# EAGLE design Reflow Panel Rev D (EAGLE 7.5.0)
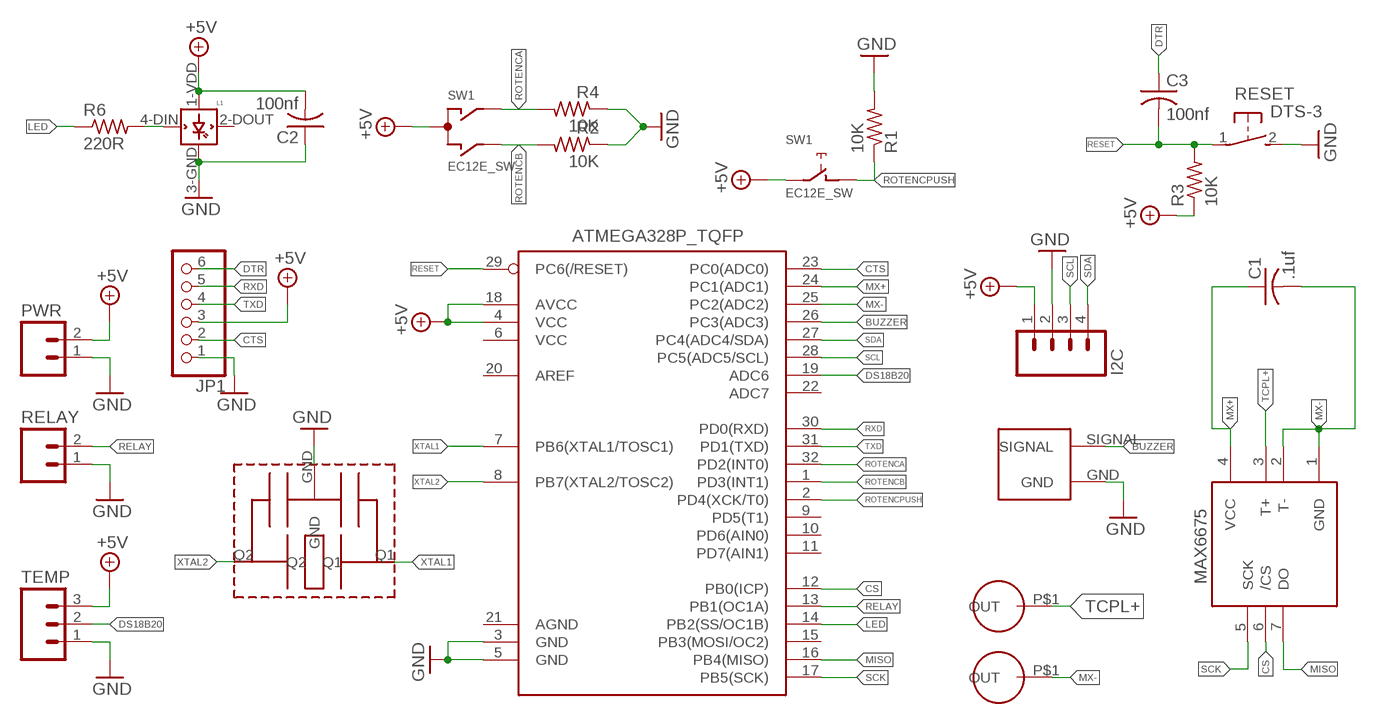
[diagram p0: schematic, sheet 1]

## Parts
C1  .1uf  C-USC0805  [C0805]
C2  100nf  C-USC0805  [C0805]
C3  100nf  C-USC0805  [C0805]
I2C  M04LOCK_LONGPADS  [1X04_LOCK_LONGPADS]
IC2  MAX6675  [SO08]
JP1  PINHD-1X6LOCK  [1X06-BIGLOCK]
L1  WS2812B_  [WS2812B]
PWR  M02LOCK  [1X02_LOCK]
R1  10K  R-US_M0805  [M0805]
R2  10K  R-US_M0805  [M0805]
R3  10K  R-US_M0805  [M0805]
R4  10K  R-US_M0805  [M0805]
R6  220R  R-US_M0805  [M0805]
RELAY  M02LOCK  [1X02_LOCK]
RESET  DTS-3  [DTS-3]
SW1  EC12E_SW  [ALPS_EC12E_SW]
TEMP  M03LOCK  [1X03_LOCK]
U1  ATMEGA328P_TQFP  [TQFP32-08]
U$1  8.5MMSQUAREBUZZER  [8.5MMSQUAREBUZZER]
U$2  CSTCE16M0V53-R0  [CSTCE_V13C]
U$3  BANANAFEMAIL-10.8-5.7  [BANANAFEMALE-10.8-5.7]
U$4  BANANAFEMAIL-10.8-5.7  [BANANAFEMALE-10.8-5.7]

## Nets
+5V: C2.2 I2C.1 JP1.3 L1.1-VDD(VDD) PWR.2 R3.1 SW1.C SW1.E TEMP.3 U1.4(VCC) U1.18(AVCC)
BUZZER: U1.26(PC3(ADC3)) U$1.SIGNAL
CS: IC2.6(/CS) U1.12(PB0(ICP))
CTS: JP1.2 U1.23(PC0(ADC0))
DS18B20: TEMP.2 U1.19(ADC6)
DTR: C3.1 JP1.6
GND: C2.1 I2C.2 JP1.1 L1.3-GND(GND) PWR.1 R1.2 R2.1 R4.1 RELAY.1 RESET.2 TEMP.1 U1.3(GND) U1.5(GND) U$1.GND U$2.GND
LED: R6.1 U1.14(PB2(SS/OC1B))
MISO: IC2.7(DO) U1.16(PB4(MISO))
MX+: C1.1 IC2.4(VCC) U1.24(PC1(ADC1))
MX-: C1.2 IC2.1(GND) IC2.2(T-) U1.25(PC2(ADC2)) U$3.P$1(OUT)
N$1: L1.4-DIN(DIN) R6.2
RELAY: RELAY.2 U1.13(PB1(OC1A))
RESET: C3.2 R3.2 RESET.1 U1.29(PC6(/RESET))
ROTENCA: R4.2 SW1.A U1.32(PD2(INT0))
ROTENCB: R2.2 SW1.B U1.1(PD3(INT1))
ROTENCPUSH: R1.1 SW1.D U1.2(PD4(XCK/T0))
RXD: JP1.5 U1.30(PD0(RXD))
SCK: IC2.5(SCK) U1.17(PB5(SCK))
SCL: I2C.3 U1.28(PC5(ADC5/SCL))
SDA: I2C.4 U1.27(PC4(ADC4/SDA))
TCPL+: IC2.3(T+) U$4.P$1(OUT)
TXD: JP1.4 U1.31(PD1(TXD))
XTAL1: U1.7(PB6(XTAL1/TOSC1)) U$2.Q1
XTAL2: U1.8(PB7(XTAL2/TOSC2)) U$2.Q2
Unconnected: L1.2-DOUT(DOUT) SW1.GND1(G) SW1.GND2(G) U1.6(VCC) U1.9(PD5(T1)) U1.10(PD6(AIN0)) U1.11(PD7(AIN1)) U1.15(PB3(MOSI/OC2)) U1.20(AREF) U1.21(AGND) U1.22(ADC7)

## Library data of the parts
C1-C3 = rcl:C-US: CAPACITOR, American symbol
I2C = User-Submitted:M04: Header 4 Standard 4-pin 0.1" header. Use with straight break away headers (SKU : PRT-00116), right angle break away headers (PRT-00553), swiss pins (PRT-00743), machine pins (PRT-00117), and female headers (PRT-00115). Molex polarized connector foot print use with SKU : PRT-08231 with associated crimp pins and housings. 1MM SMD Version SKU: PRT-10208
IC2 = adafruit:MAX6675
JP1 = adafruit:PINHD-1X6: PIN HEADER
L1 = adafruit:WS2812B_
PWR RELAY = SparkFun-Connectors:M02: Standard 2-pin 0.1" header. Use with - straight break away headers ( PRT-00116) - right angle break away headers (PRT-00553) - swiss pins (PRT-00743) - machine pins (PRT-00117) - female headers (PRT-00115) Molex polarized connector foot print use with: PRT-08233 with associated crimp pins and housings. 2.54_SCREWTERM for use with PRT-10571. 3.5mm Screw Terminal footprints for PRT-08084 5mm Screw Terminal footprints for use with PRT-08432
R1-R4 R6 = rcl:R-US_: RESISTOR, American symbol
RESET = switch-tact:DTS-3
SW1 = switch-alps:EC12E_SW: ALPS rotary Encoder EC12E series with switch; MPN: EC12E2424407; OC_FARNELL: 1520813; OC_NEWARK: 74M1068
TEMP = SparkFun-Connectors:M03: Header 3 Standard 3-pin 0.1" header. Use with straight break away headers (SKU : PRT-00116), right angle break away headers (PRT-00553), swiss pins (PRT-00743), machine pins (PRT-00117), and female headers (PRT-00115). Molex polarized connector foot print use with SKU : PRT-08232 with associated crimp pins and housings.
U1 = SparkFun-DigitalIC:ATMEGA328P_TQFP; PROD_ID: IC-09069
U$1 = custom:8.5MMSQUAREBUZZER
U$2 = custom:CSTCE16M0V53-R0
U$3 U$4 = custom:BANANAFEMAIL-10.8-5.7

## Board
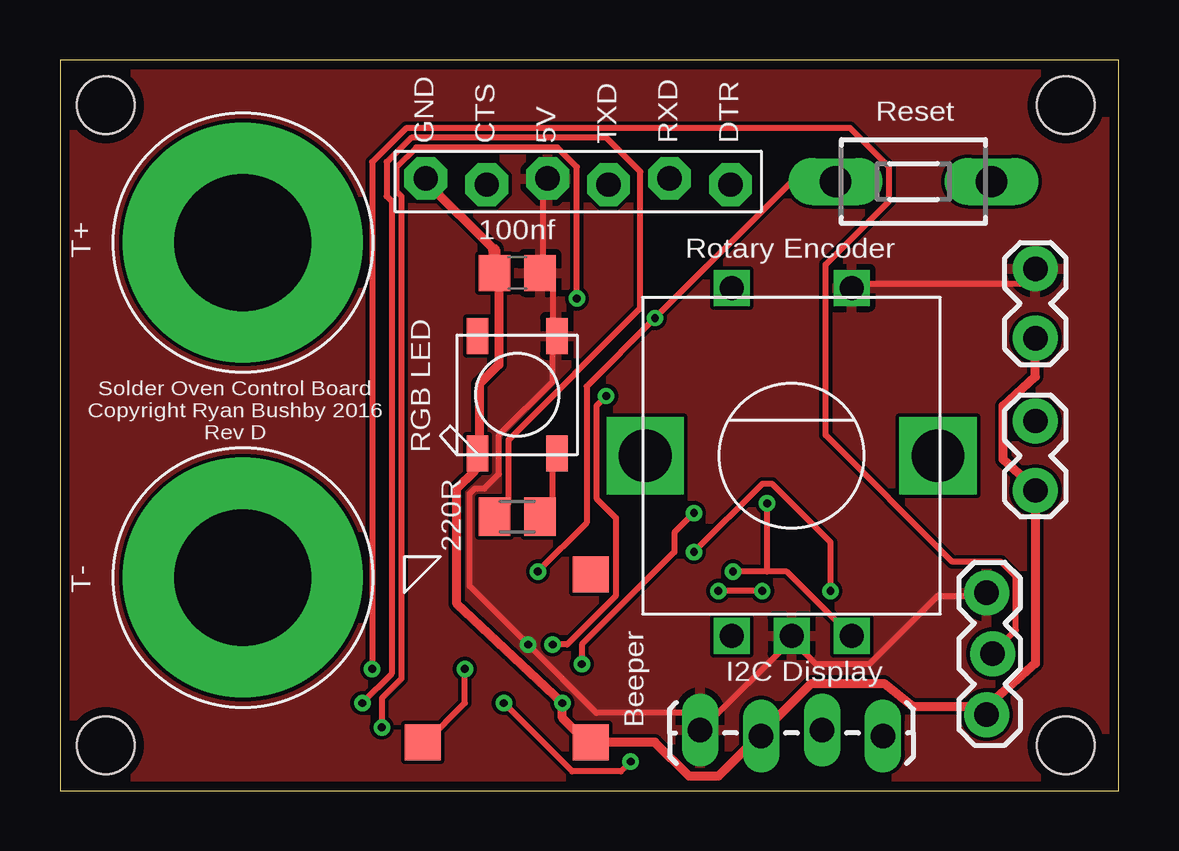
[diagram p1: board, top side]
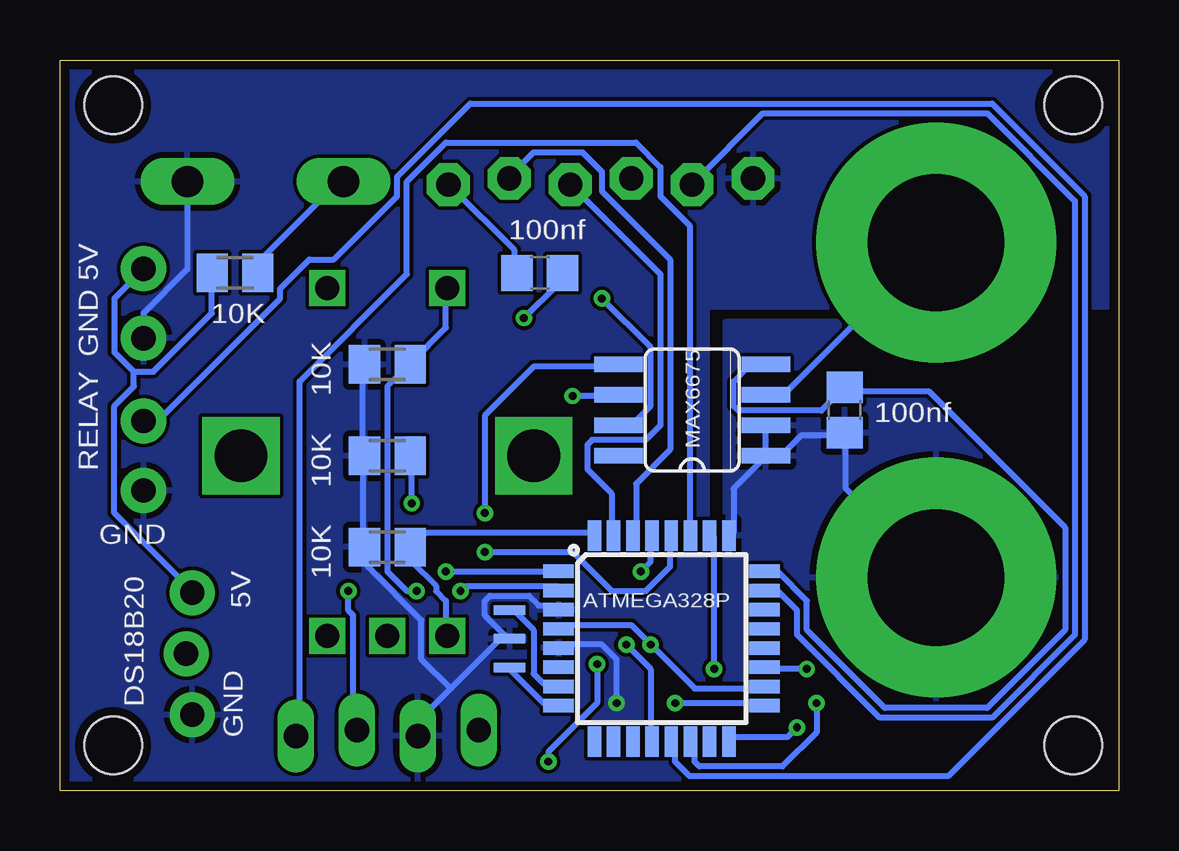
[diagram p2: board, bottom side, seen from below]

Size 44.12 x 30.47 mm. Coordinates in mm from the lower left corner, seen from the top.
Outline: 0,0 44.12,0 44.12,30.47 0,30.47 0,0
Copper layers (1*16): Top 0.0356mm / dielectric 1.5011mm / Bottom 0.0356mm
Design rules "LaenPCBOrder *": minimum track width 10mil, minimum drill 13mil, track to track 6mil, track to pad 6mil, pad to pad 6mil, via to via 6mil, smd to smd 6mil, copper to edge 15mil, drill to drill 6mil, minimum pad ring 7mil, minimum via ring 7mil, stop-mask expansion 3mil, vias tented up to drill 1000mil, thermal gap 10mil
Holes 2.4 mm at 1.91,1.91 1.91,28.57 41.91,28.57 41.91,1.91

### Footprints (pad centres in the part's own frame; a part is rotated, then mirrored left to right if it is on the bottom)
C0805 = smd 1.3 x 1.5: 1 -0.95,0; 2 0.95,0
1X04_LOCK_LONGPADS = drill 1.016 long: 1 0,0; 2 2.54,-0.254; 3 5.08,0; 4 7.62,-0.254
SO08 = smd 0.66 x 2.032: 1 -1.905,-3.073; 2 -0.635,-3.073; 3 0.635,-3.073; 4 1.905,-3.073; 5 1.905,3.073; 6 0.635,3.073; 7 -0.635,3.073; 8 -1.905,3.073
1X06-BIGLOCK = drill 1.016 pad 1.778 octagon: 1 -6.35,0.127; 2 -3.81,-0.127; 3 -1.27,0.127; 4 1.27,-0.127; 5 3.81,0.127; 6 6.35,-0.127
WS2812B = smd 1.5 x 0.9: 1-VDD 2.45,-1.65; 2-DOUT 2.45,1.65; 3-GND -2.45,1.65; 4-DIN -2.45,-1.65
1X02_LOCK = drill 1.016 pad 1.88: 1 -0.178,0; 2 2.718,0
M0805 = smd 1.3 x 1.6: 1 -0.95,0; 2 0.95,0
DTS-3 = drill 1.3 long: 1 -3.25,0; 2 3.25,0
ALPS_EC12E_SW = drill 1 square: A -2.5,-7.5; B 2.5,-7.5; C 0,-7.5; D -2.5,7; E 2.5,7 | drill 2.2 square: GND1 -6.1,0; GND2 6.1,0
1X03_LOCK = drill 1.016 pad 1.88: 1 0,0.127; 2 2.54,-0.127; 3 5.08,0.127
TQFP32-08 = smd 1.27 x 0.559: 1 -4.293,2.8; 2 -4.293,2; 3 -4.293,1.2; 4 -4.293,0.4; 5 -4.293,-0.4; 6 -4.293,-1.2; 7 -4.293,-2; 8 -4.293,-2.8; 17 4.293,-2.8; 18 4.293,-2; 19 4.293,-1.2; 20 4.293,-0.4; 21 4.293,0.4; 22 4.293,1.2; 23 4.293,2; 24 4.293,2.8 | smd 0.559 x 1.27: 9 -2.8,-4.293; 10 -2,-4.293; 11 -1.2,-4.293; 12 -0.4,-4.293; 13 0.4,-4.293; 14 1.2,-4.293; 15 2,-4.293; 16 2.8,-4.293; 25 2.8,4.293; 26 2,4.293; 27 1.2,4.293; 28 0.4,4.293; 29 -0.4,4.293; 30 -1.2,4.293; 31 -2,4.293; 32 -2.8,4.293
8.5MMSQUAREBUZZER = smd 1.5 x 1.5: GND 8.14,0.75; P$3 8.14,7.75; SIGNAL 1.14,0.75
CSTCE_V13C = smd 0.4 x 1.3: GND 0.01,0.01; Q1 -1.19,0.01; Q2 1.21,0.01
BANANAFEMALE-10.8-5.7 = drill 5.7 pad 10: P$1 0,0

### Placement (x,y rotation side)
C1  11.43,15.88 270 bottom
C2  19.05,21.59 0 top
C3  24.13,21.59 0 bottom
I2C  26.67,2.54 0 top
IC2  17.78,15.88 90 bottom
JP1  21.59,25.4 0 top
L1  19.05,16.51 90 top
PWR  40.64,19.05 90 top
R1  30.48,17.78 180 bottom
R2  30.48,13.97 0 bottom
R3  36.83,21.59 0 bottom
R4  30.48,10.16 0 bottom
R6  19.05,11.43 0 top
RELAY  40.64,12.7 90 top
RESET  35.56,25.4 0 top
SW1  30.48,13.97 0 top
TEMP  38.73,3.17 90 top
U1  19.05,6.35 0 bottom
U$1  13.97,1.27 0 top
U$2  25.4,6.35 270 bottom
U$3  7.62,8.89 0 top
U$4  7.62,22.86 0 top

### Tracks (layer width: path | path; a pad name or v marks a point on that pad's centre or on a via)
+5V  (via drill 0.33)
  Top 0.254: SW1.E 33.12,21.13 40.03,21.13 40.64,21.74 PWR.2 | JP1.3 20.32,25.4 20.12,25.2 20.12,21.74 C2.2 20.12,21.54 20.52,21.13 20.52,19.1 L1.1-VDD 20.52,18.9 20.52,17.07 18.29,14.83 18.29,13.21 17.68,12.6 17.27,12.6 17.07,12.39 17.07,8.53 v19.51,6.1 22.35,3.25 26.01,3.25 26.62,2.64 I2C.1 26.82,2.64 30.48,6.3 | 30.48,6.3 31.5,5.28 33.73,5.28 36.58,8.13 38.61,8.13 TEMP.3 | 30.48,6.3 SW1.C
  Bottom 0.254: 41.05,17.48 40.23,17.48 37.8,19.91 37.8,21.54 R3.1 | 41.05,17.48 41.86,18.29 41.86,20.52 40.64,21.74 PWR.2 | U1.18 14.83,4.27 17.68,4.27 v19.51,6.1 20.32,6.91 23.16,6.91 U1.4 | 41.05,17.48 41.05,16.87 41.86,16.05 41.86,11.58 38.61,8.33 TEMP.3
  pour Top: 0,30.48 44.45,30.48 44.45,0 0,0
BUZZER  (via drill 0.33)
  Top 0.254: v16.87,5.08 16.87,3.66 15.24,2.03 U$1.SIGNAL
  Bottom 0.254: v16.87,5.08 16.87,10.57 U1.26
CS  (via drill 0.33)
  Top 0.254: v20.52,6.1 21.13,6.1 23.16,8.13 23.16,11.38 22.35,12.19 22.35,16.05 v22.76,16.46
  Bottom 0.254: v20.52,6.1 19.51,5.08 19.51,2.23 U1.12 | v22.76,16.46 20.93,16.46 IC2.6
CTS
  Bottom 0.254: U1.23 14.63,8.33 14.22,8.33 13.41,7.52 13.41,6.5 9.96,3.05 5.28,3.05 1.83,6.5 1.83,24.59 5.49,28.25 14.83,28.25 17.68,25.4 JP1.2
DS18B20  (via drill 0.33)
  Top 0.254: v13.01,5.08 13.01,26.21 14.43,27.64 32.92,27.64 34.54,26.01 34.54,24.59 31.9,21.95 31.9,14.83 37.19,9.55 39.22,9.55 39.83,8.94 39.83,6.71 39.01,5.89 TEMP.2
  Bottom 0.254: v13.01,5.08 14.63,5.08 U1.19
DTR
  Bottom 0.254: C3.1 25.2,21.74 25.2,22.55 27.84,25.2 JP1.6
GND  (via drill 0.33)
  Top 0.254: 40.64,12.6 RELAY.1 | 17.48,14.22 L1.3-GND 17.27,14.02 | 18.29,21.54 C2.1 18.09,21.74 | 21.95,2.03 U$1.GND 22.15,2.03 | 29.06,2.23 I2C.2 29.26,2.44 | 38.61,3.25 TEMP.1
  Top 0.381: 38.61,3.53 TEMP.1 | 38.61,3.53 40.64,5.31 RELAY.1 | PWR.1 40.64,17.27 39.29,16.05 39.29,13.82 40.64,12.6 | 17.48,14.22 17.48,16.95 18.29,17.77 18.29,21.54 | 18.09,22.55 15.24,25.4 JP1.1 | 21.95,2.03 20.93,3.05 v20.93,3.66 16.54,7.8 16.54,12.6 17.27,13.34 17.27,14.02 | 22.15,2.03 24.79,2.03 26.21,0.61 27.43,0.61 29.06,2.23 | 38.61,3.53 35.53,3.53 34.34,4.47 31.29,4.47 29.26,2.44
  Top 0.508: 18.09,22.55 18.09,21.74
  Bottom 0.254: PWR.1 40.64,19.91 38.81,21.74 RESET.2 | 15.24,25.4 JP1.1 | R1.2 31.5,17.68 31.5,14.02 R2.1 31.5,13.82 31.5,10.16 R4.1 31.29,10.16 31.29,9.35 29.06,7.11 29.06,5.49 27.84,4.27 | v20.93,3.66 20.93,5.49 21.54,6.1 23.16,6.1 U1.5 | 25.6,6.5 25.4,6.3 U$2.GND 25.6,6.5 | 25.6,6.5 26.42,7.32 26.42,7.92 26.21,8.13 24.59,8.13 24.18,7.72 23.37,7.72 U1.3 | 27.84,4.27 29.06,3.05 29.06,2.44 I2C.2 | 27.84,4.27 25.6,6.5
  pour Bottom: 44.2,0 17.14,0 17.14,20.19 0.13,20.19 0.13,30.61 44.2,30.61
LED  (via drill 0.33)
  Top 0.254: v12.6,3.66 13.82,4.88 13.82,24.59 13.61,24.79 13.61,26.21 14.63,27.23 22.76,27.23 24.18,25.81 24.18,20.12 18.69,14.63 18.69,11.99 18.29,11.58 R6.1
  Bottom 0.254: v12.6,3.66 12.6,2.44 14.02,1.02 17.48,1.02 17.68,1.22 17.68,2.03 U1.14
MISO  (via drill 0.33)
  Top 0.254: v13.41,2.64 13.41,3.86 14.22,4.67 14.22,24.79 14.02,24.99 14.02,26.01 14.83,26.82 20.73,26.82 21.54,26.01 v21.54,20.52
  Bottom 0.254: v13.41,2.64 13.82,2.23 16.05,2.23 U1.16 | v21.54,20.52 19.51,18.49 19.51,16.05 20.32,15.24 IC2.7
MX+
  Bottom 0.254: U1.24 14.63,9.14 14.22,9.14 13.01,7.92 13.01,6.71 9.75,3.45 5.49,3.45 2.23,6.71 2.23,10.97 7.92,16.66 11.38,16.66 C1.1 11.58,16.66 12.39,15.85 15.85,15.85 16.05,16.05 16.05,17.07 15.44,17.68 14.83,17.68 IC2.4
MX-
  Bottom 0.254: U1.25 16.05,10.77 16.05,12.6 14.83,13.82 IC2.1 14.63,14.02 | 14.63,14.02 14.02,14.02 13.21,14.83 11.58,14.83 C1.2 11.38,14.83 11.38,12.6 7.72,8.94 U$3.P$1 | 14.63,14.02 14.71,14.02 IC2.2
  pour Bottom: 16.38,-0.13 16.38,19.56 0,19.56 0,-0.13
N$1
  Top 0.254: L1.4-DIN 20.52,14.02 20.52,11.99 20.12,11.58 R6.2
RELAY
  Bottom 0.254: U1.13 18.49,2.03 18.49,1.22 17.88,0.61 7.11,0.61 1.42,6.3 1.42,24.79 5.28,28.65 27.03,28.65 30.07,25.6 30.07,24.79 32.72,22.15 33.73,22.15 34.95,20.93 34.95,20.52 40.03,15.44 40.64,15.44 RELAY.2
RESET  (via drill 0.33)
  Top 0.254: v19.91,9.14 21.95,11.18 21.95,16.87 v24.79,19.71 30.48,25.4 RESET.1
  Bottom 0.254: v19.91,9.14 19.51,9.55 19.51,10.57 U1.29 | v24.79,19.71 23.37,21.13 23.37,21.54 C3.2 | R3.2 35.76,21.74 35.76,22.15 32.51,25.4 RESET.1
ROTENCA
  Bottom 0.254: 29.46,10.16 28.85,10.77 21.95,10.77 U1.32 | 29.46,10.16 29.46,9.55 28.45,8.53 28.45,8.33 28.04,7.92 28.04,6.5 SW1.A | 29.46,10.16 R4.2
ROTENCB  (via drill 0.33)
  Top 0.254: 29.46,9.14 30.28,9.14 32.92,6.5 SW1.B | 29.46,9.14 v28.04,9.14 | 29.46,9.14 v29.46,11.99
  Bottom 0.254: v28.04,9.14 23.37,9.14 U1.1 | v29.46,11.99 29.46,13.82 R2.2
ROTENCPUSH  (via drill 0.33)
  Top 0.254: v29.26,8.33 v27.43,8.33
  Bottom 0.254: v27.43,8.33 27.23,8.53 23.37,8.53 U1.2 | v29.26,8.33 29.67,8.33 30.48,9.14 30.48,16.87 29.67,17.68 R1.1 29.46,17.88 28.04,19.3 28.04,20.93 SW1.D
RXD
  Bottom 0.254: U1.30 20.12,10.77 20.12,12.8 18.69,14.22 18.69,22.15 21.54,24.99 21.54,25.81 22.35,26.62 24.38,26.62 25.4,25.6 JP1.5
SCK  (via drill 0.33)
  Top 0.254: v18.49,3.66 21.34,0.81 23.37,0.81 v23.77,1.22 | v21.74,5.28 21.74,6.1 25.6,9.96 25.6,10.77 v26.42,11.58
  Bottom 0.254: v18.49,3.66 14.83,3.66 U1.17 | v23.77,1.22 23.77,1.63 21.74,3.66 v21.74,5.28 | v26.42,11.58 26.42,15.65 24.38,17.68 20.93,17.68 IC2.5
SCL  (via drill 0.33)
  Top 0.254: v26.42,9.96 29.26,12.8 29.67,12.8 32.11,10.36 v32.11,8.33
  Bottom 0.254: v26.42,9.96 22.76,9.96 21.13,8.33 19.71,8.33 18.69,9.35 18.69,10.57 U1.28 | v32.11,8.33 32.11,7.52 31.9,7.32 31.9,2.64 I2C.3
SDA
  Bottom 0.254: U1.27 17.88,10.77 17.88,23.57 19.1,24.79 19.1,26.01 20.12,27.03 28.04,27.03 29.67,25.4 29.67,21.54 34.14,17.07 34.14,2.44 I2C.4
TCPL+
  Bottom 0.254: U$4.P$1 13.82,16.66 14.63,16.66 IC2.3
TXD
  Bottom 0.254: U1.31 21.13,10.77 21.13,12.39 22.15,13.41 22.15,14.43 21.95,14.63 19.71,14.63 19.1,15.24 19.1,21.54 22.76,25.2 JP1.4
XTAL1
  Bottom 0.254: U1.7 23.37,4.47 23.98,4.47 24.38,4.88 24.38,6.71 25.2,7.52 U$2.Q1
XTAL2
  Bottom 0.254: U1.8 23.37,3.66 23.98,3.66 25.4,5.08 U$2.Q2

### Text on the board
tPlace: Reset | GND | CTS | 5V | TXD | RXD | DTR | 100nf | T+ | Rotary Encoder | RGB LED | Solder Oven Control Board / Copyright Ryan Bushby 2016 / Rev D | 220R | T- | Beeper | I2C Display
bPlace: 100nf | 5V | 10K | 10K | GND | 100nf | 10K | MAX6675 | RELAY | 10K | GND | ATMEGA328P | 5V | DS18B20 | GND